# EasyEDA schematic Doorbell_2021-06-07.json
TITLE: Doorbell; REV: 1.0; Date: 2021-06-07; Sheet: 1/1; Drawn By: r3mko; Company: r3mko.nl
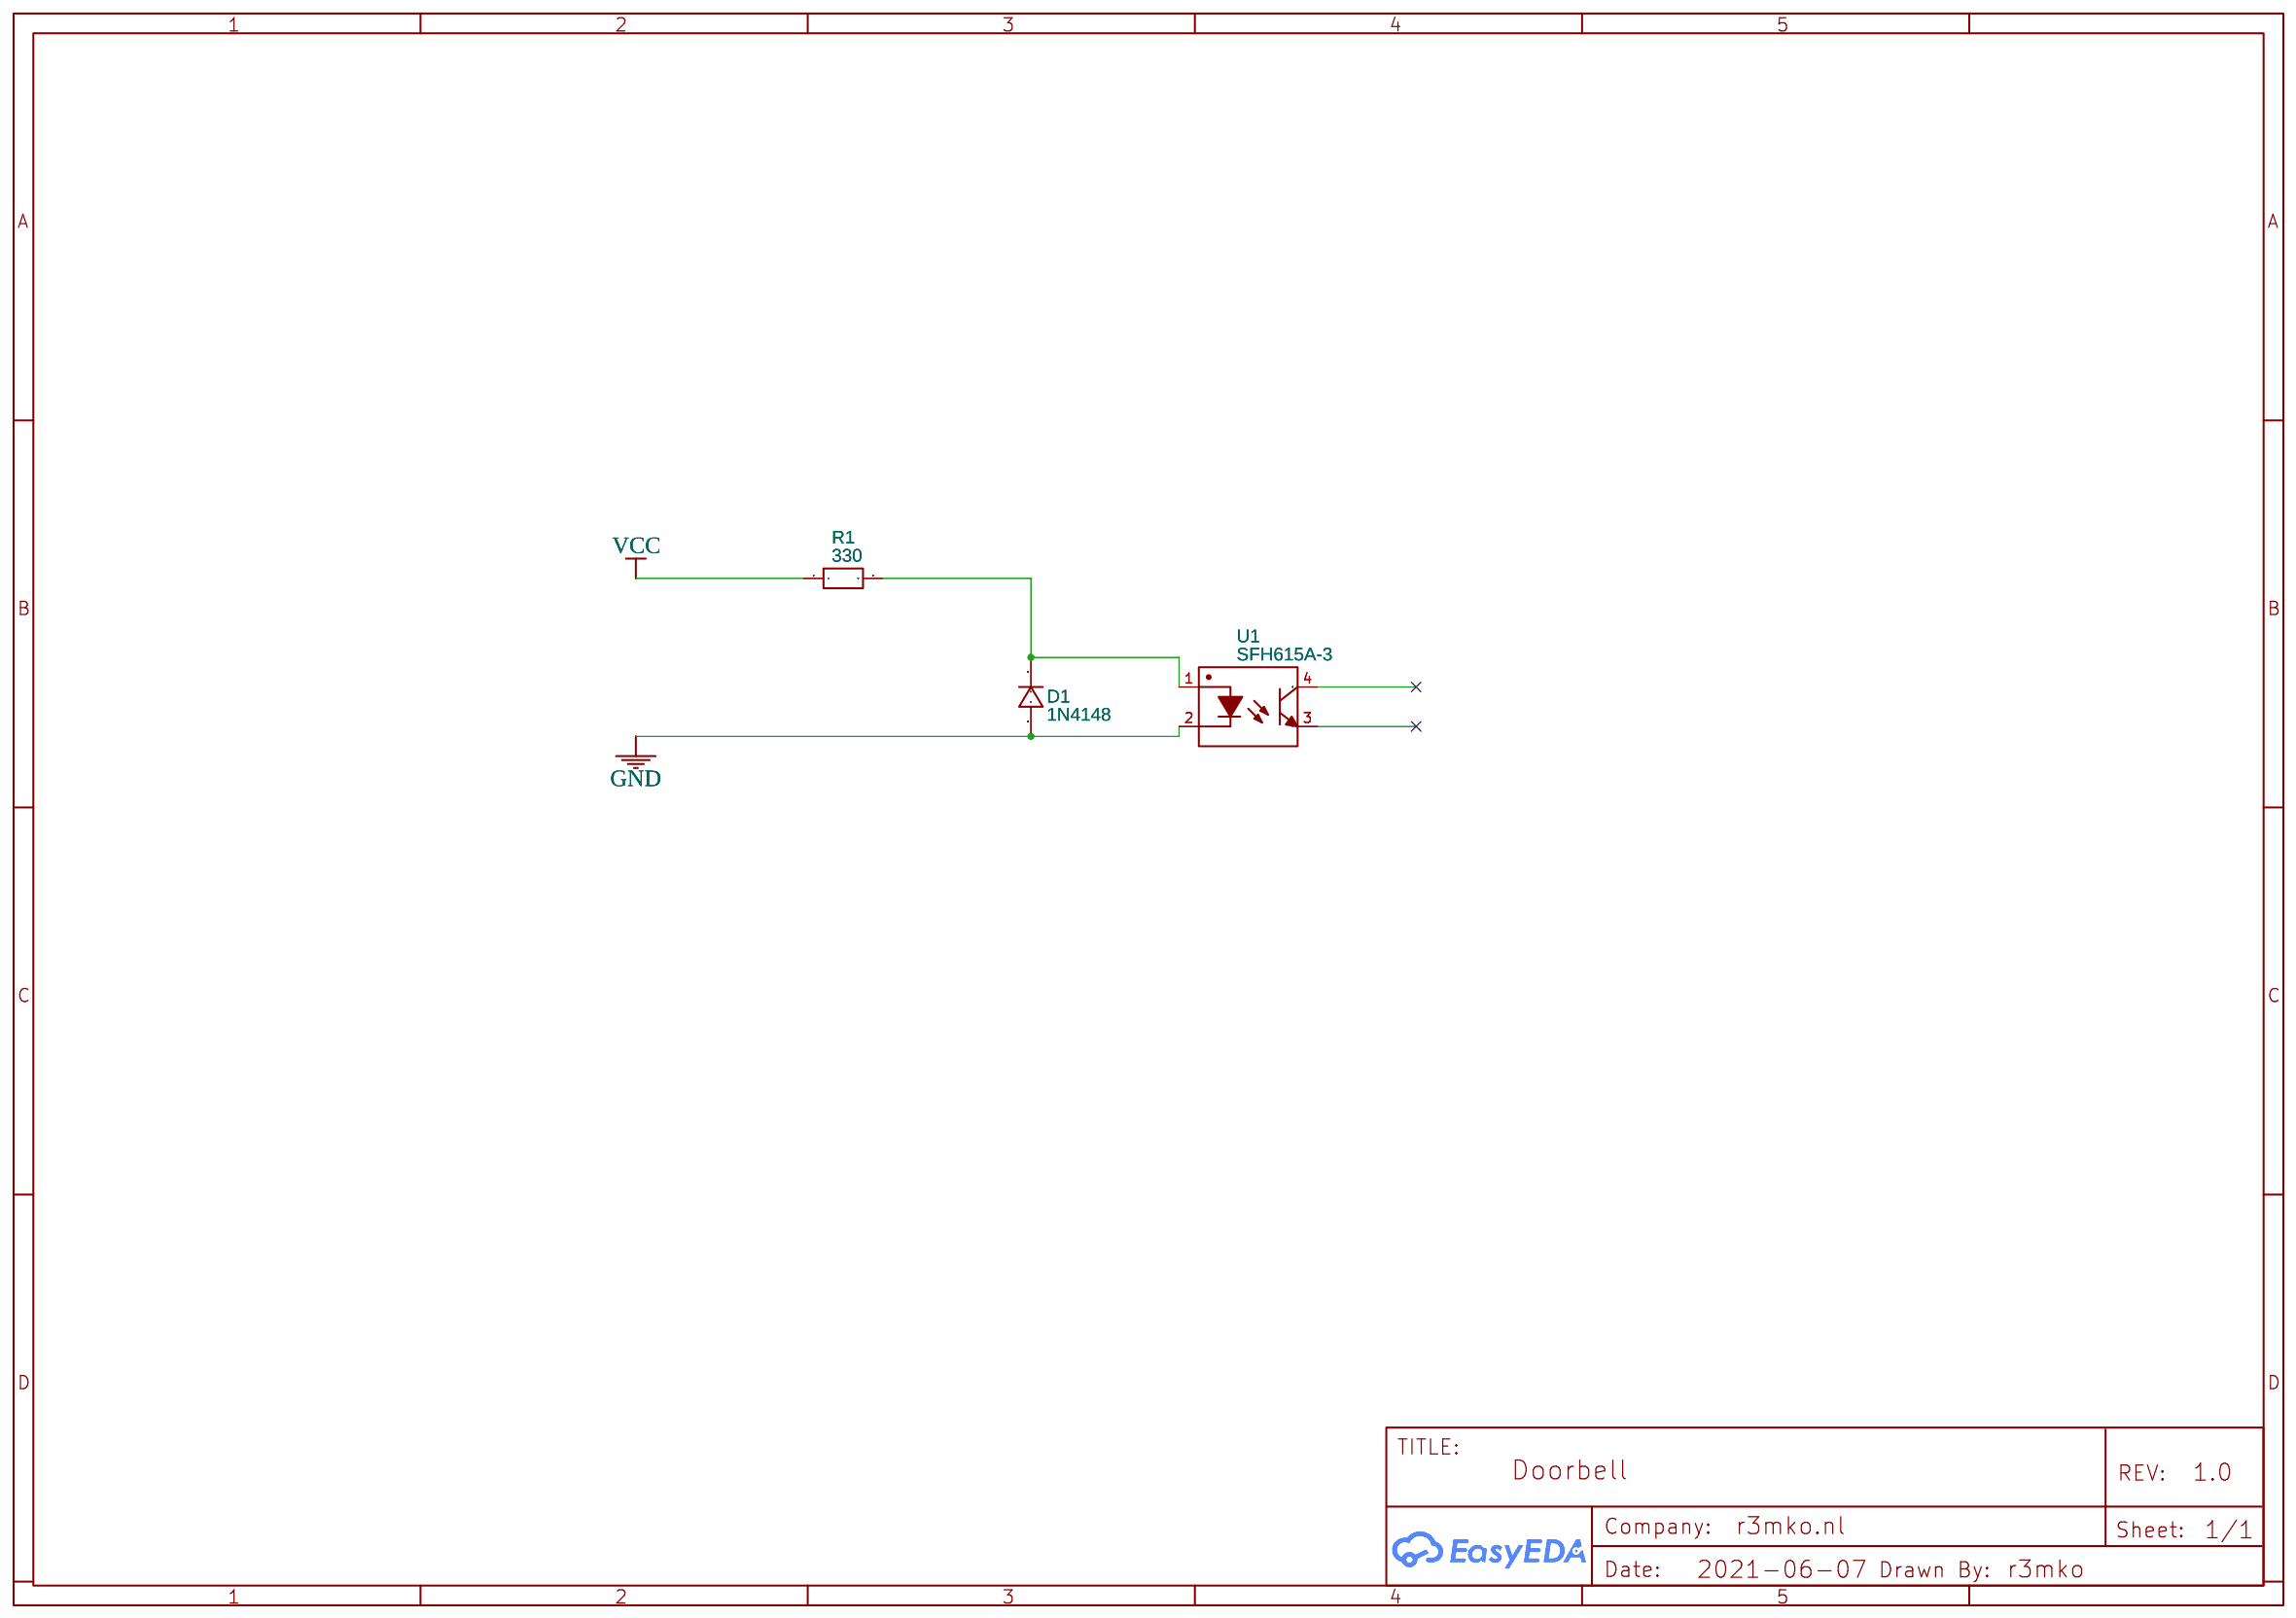
[diagram p0: schematic sheet]

## Parts
D1  1N4148  [DO-35_BD2.0-L4.0-P8.00-D0.5-FD]
R1  330  [R_AXIAL-0.3]
U1  SFH615A-3  [DIP-4_L4.6-W6.5-P2.54-LS7.6-BL]

## Library data of the parts
D1 = 1N4148: Supplier: LCSC; Manufacturer: SEMTECH; Supplier Part: C14516; Contributor: LCEDA_Lib
R1 = R_AXIAL-0.3_EU: Contributor: LCEDA_Lib
U1 = SFH615A-3: Supplier: LCSC; Supplier Part: C500641; Manufacturer: Vishay Intertech; Contributor: LCSC

## Nets
GND: D1.1 U1.2(C)
VCC: R1.1
Net-(D1-2): D1.2 R1.2 U1.1(A)

Not connected (* = marked no-connect by the designer): U1 3(E) 4(C)
